# Altium schematic sheet AUX_Stufe.SchDoc: Ausgangsstufe
size A4 portrait; DocumentNumber: 4; Revision: 2; SheetNumber: 4; SheetTotal: 4
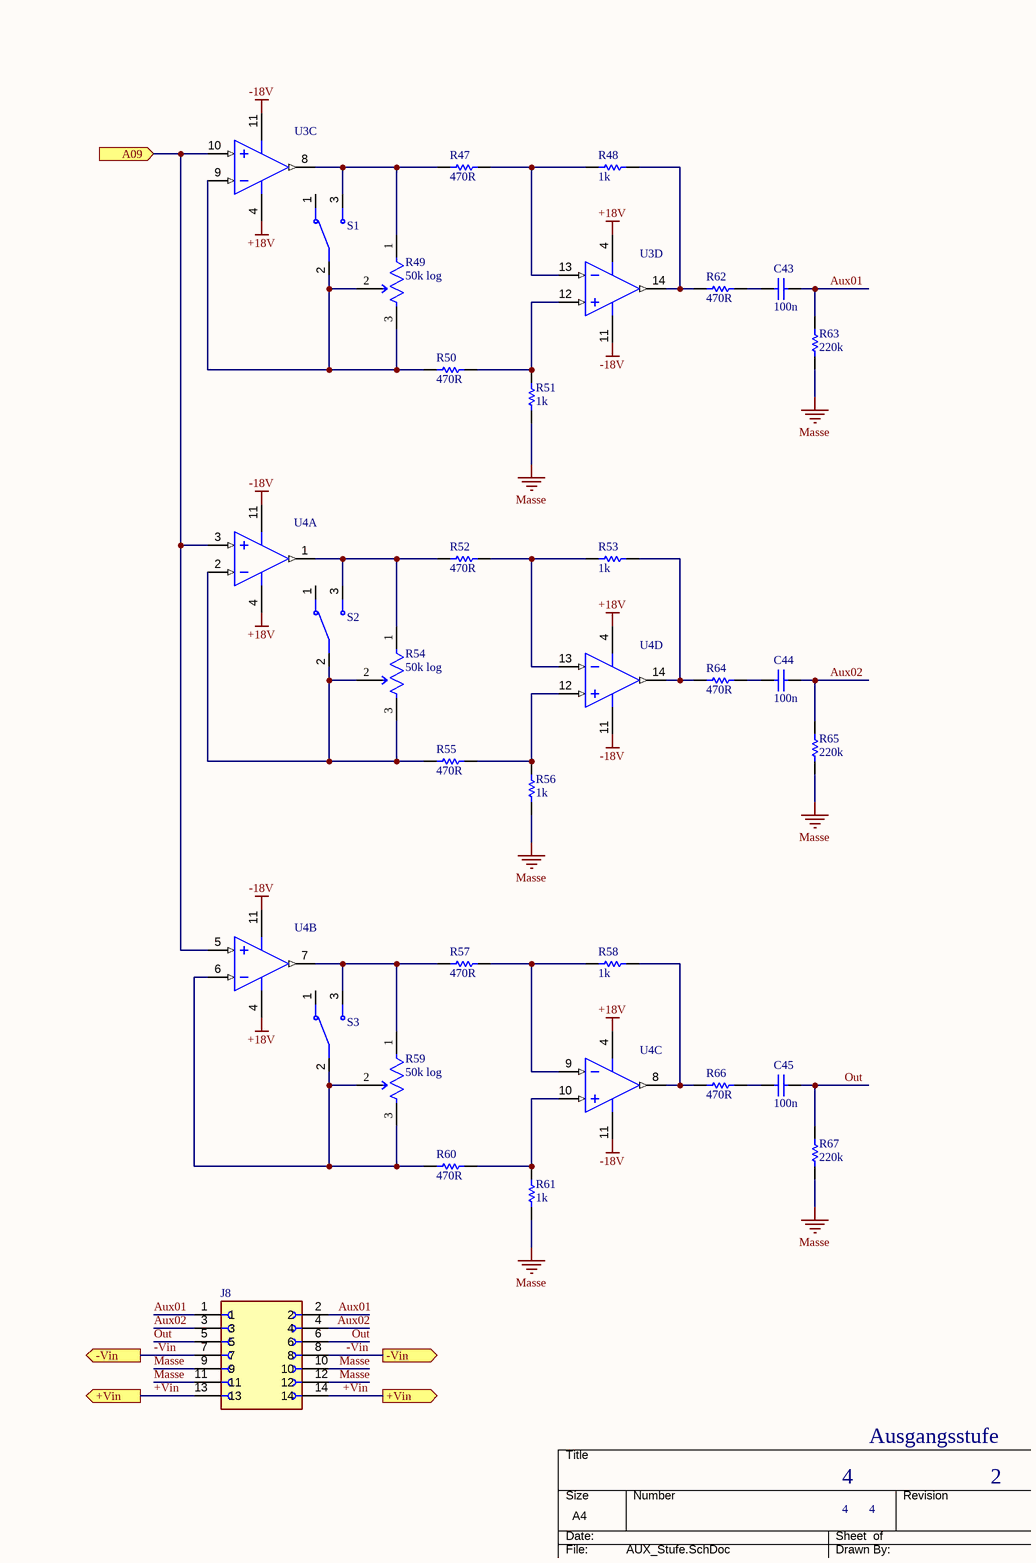
[diagram p0: AUX_Stufe.SchDoc]

## Parts
C43  100n  [0805]
C44  100n  [0805]
C45  100n  [0805]
J8  Connector x14  [Connector x14]  (value not drawn)
R47  470R  [0805]
R48  1k  [0805]
R49  50k log  [Connector x3]
R50  470R  [0805]
R51  1k  [0805]
R52  470R  [0805]
R53  1k  [0805]
R54  50k log  [Connector x3]
R55  470R  [0805]
R56  1k  [0805]
R57  470R  [0805]
R58  1k  [0805]
R59  50k log  [Connector x3]
R60  470R  [0805]
R61  1k  [0805]
R62  470R  [0805]
R63  220k  [0805]
R64  470R  [0805]
R65  220k  [0805]
R66  470R  [0805]
R67  220k  [0805]
S1  Schalter Buchsenleiste  [Connector x3]  (value not drawn)
S2  Schalter Buchsenleiste  [Connector x3]  (value not drawn)
S3  Schalter Buchsenleiste  [Connector x3]  (value not drawn)
U3  OPA4134UA  [DIP14 IC Socket]  (value not drawn)  (parts C,D of 4)
U4  OPA4134UA  [DIP14 IC Socket]  (value not drawn)  (parts A,B,C,D of 4)

## Ports
+Vin (out), -Vin (out), A09 (in)

## Nets
+18V: U3.4(V+) U4.4(V+)
-18V: U3.11(V-) U4.11(V-)
Masse: J8.9 J8.10 J8.11 J8.12 R51.1 R56.1 R61.1 R63.1 R65.1 R67.1
+Vin: J8.13 J8.14 ; port +Vin
-Vin: J8.7 J8.8 ; port -Vin
A09: U3.10(IN_C+) U4.3(IN_A+) U4.5(IN_B+) ; port A09
Aux01: C43.2 J8.1 J8.2 R63.2
Aux02: C44.2 J8.3 J8.4 R65.2
Out: C45.2 J8.5 J8.6 R67.2
NetC43_1: C43.1 R62.2
NetC44_1: C44.1 R64.2
NetC45_1: C45.1 R66.2
NetR47_1: R47.1 R49.1(a) S1.3 U3.8(OUT_C)
NetR47_2: R47.2 R48.1 U3.13(IN_D-)
NetR48_2: R48.2 R62.1 U3.14(OUT_D)
NetR49_2: R49.2(b) R49.3(c) R50.1 S1.2 U3.9(IN_C-)
NetR50_2: R50.2 R51.2 U3.12(IN_D+)
NetR52_1: R52.1 R54.1(a) S2.3 U4.1(OUT_A)
NetR52_2: R52.2 R53.1 U4.13(IN_D-)
NetR53_2: R53.2 R64.1 U4.14(OUT_D)
NetR54_2: R54.2(b) R54.3(c) R55.1 S2.2 U4.2(IN_A-)
NetR55_2: R55.2 R56.2 U4.12(IN_D+)
NetR57_1: R57.1 R59.1(a) S3.3 U4.7(OUT_B)
NetR57_2: R57.2 R58.1 U4.9(IN_C-)
NetR58_2: R58.2 R66.1 U4.8(OUT_C)
NetR59_2: R59.2(b) R59.3(c) R60.1 S3.2 U4.6(IN_B-)
NetR60_2: R60.2 R61.2 U4.10(IN_C+)

Not connected (* = marked no-connect by the designer): S1 1; S2 1; S3 1

## Notes on the sheet
- THIS DOCUMENT AND THE DATA DISCLOSED HEREIN OR
- HEREWITH IS THE PROPERTY OF ALTIUM LIMITED AND MAY
- DWG NO:
- REVISION
- REV:
- DESCRIPTION
- DATE
- APPROVED
- BE FREELY DISTRIBUTED IN WHOLE. NO RIGHTS ARE
- RESERVED OR EXPRESS OR IMPLIED WARANTEE GIVEN.
- ENG:
- APPROVALS
- PROJECT
- DSN:
- CHK:
- REFERENCE DOCUMENTS
- PROJECT REVISION:
- TITLE
- DOCUMENT REVISION:
- DESIGN ITEM:
- BOM:
- FAB DWG:
- PCB DWG:
- ASSY DWG:
- SCALE:
- A3
- SIZE
- CAGE CODE
- FILE NAME
- DWG NO.
- SHEET
- OF
- REV

## Library data of the parts
C43-C45 = 0805 Kondensator: Value: 100n
J8 = Connector x14: 14 Position Header Connector Through Hole; MF: Sullins Connector; MP: SFH11-PBPC-D07-ST-BK; Value: *; Check_prices: https://www.snapeda.com/parts/SFH11-PBPC-D07-ST-BK/Sullins%20Connector%20Solutions/view-part/851415/?ref=eda; Availability: Warning; Package: None; SnapEDA_Link: https://www.snapeda.com/parts/SFH11-PBPC-D07-ST-BK/Sullins%20Connector%20Solutions/view-part/851415/?ref=snap; Purchase-URL: https://pricing.snapeda.com/search/part/SFH11-PBPC-D07-ST-BK/?ref=eda; Price: None
R47 R48 R50-R53 R55-R58 R60-R67 = 0805 Widerstand
  R47 R50 R52 R55 R57 R60 R62 R64 R66: Value: 470R
  R48 R51 R53 R56 R58 R61: Value: 1k
  R63 R65 R67: Value: 220k
R49 R54 R59 = Potentiometer Buchsenleiste: Potentiometer; Value: 50k log
S1-S3 = Schalter Buchsenleiste: Toggle Switch SPDT Through Hole; MP: 100SP1T1B4M2QE; Package: None; Price: None; Value: *; Availability: Unavailable
U3 U4 = SOIC OPA4134UA: SoundPlus(TM) High Performance Audio Operational Amplifier, 5 to 36 V, -55 to 125 degC, 14-pin SOIC (D14), Green (RoHS & no Sb/Br); Manufacturer: Texas Instruments; Vmax(V): 36; Number of Channels: 4; Iq per channel(Max)(mA): 5; GBW(Typ)(MHz): 8; DatasheetVersion: SBOS058; ComponentLink2URL: http://www.ti.com/general/docs/lit/getliterature.tsp?genericPartNumber=OPA4134&fileType=pdf; ComponentLink1URL: http://www.ti.com/; PackageDescription: 14-Pin Plastic Small Outline, Body 8.65 x 3.9 mm, Pitch 1.27 mm; SubFamily: Audio Operational Amplifier; Vmin(V): 5; ComponentLink2Description: Datasheet; PackageVersion: 4040047-5/M, 06/2011; Code_JEDEC: MS-012; PackageReference: D0014A; ComponentLink1Description: Manufacturer URL; Vn at Flatband(Typ)(nV/rtHz): 8; Eco-Plan: Green (RoHS & no Sb/Br); Mounting Technology: Surface Mount; ComponentLink3URL: http://www.ti.com/lit/ml/mpds177g/mpds177g.pdf; PartNumber: OPA4134UA; ComponentLink3Description: Package Specification